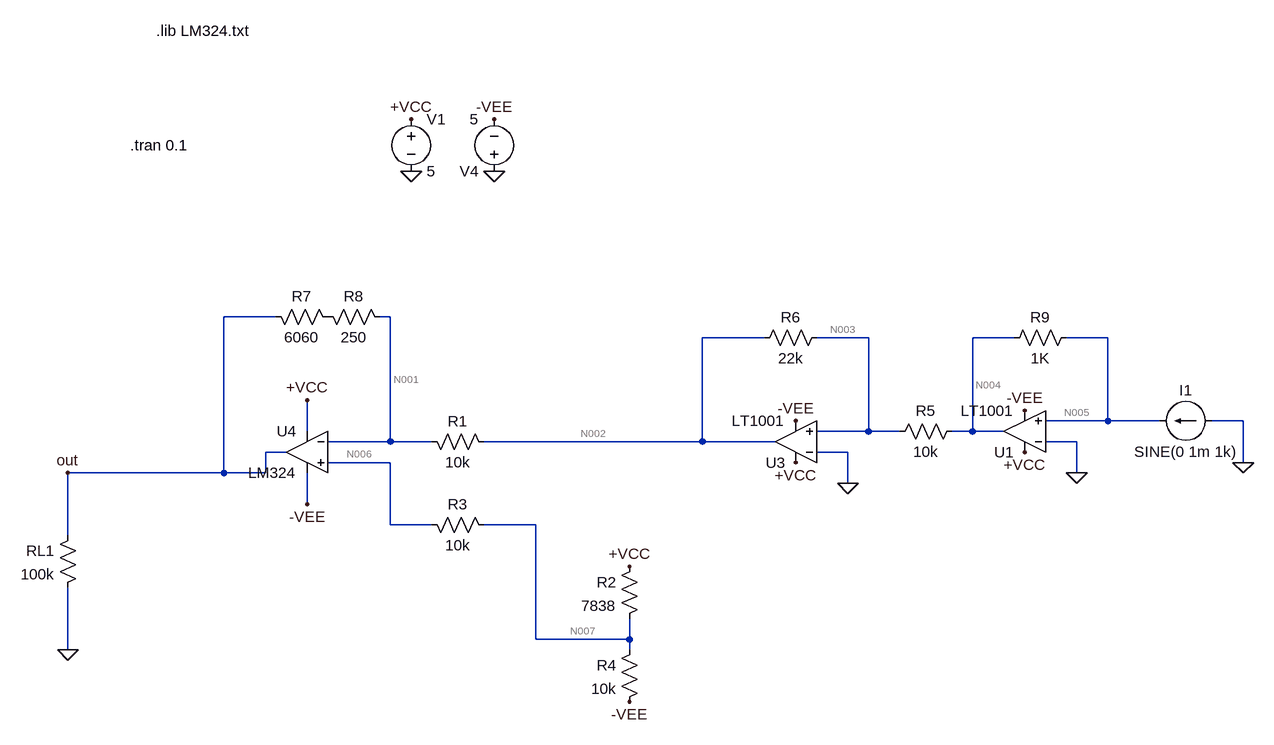
[diagram p0: schematic amplificador_i.asc]
amplificador_i.asc, the LTspice schematic file:
Version 4
SHEET 1 2848 980
WIRE -560 -32 -640 -32
WIRE -384 -32 -400 -32
WIRE 192 0 96 0
WIRE 352 0 272 0
WIRE 576 0 512 0
WIRE 720 0 656 0
WIRE 720 128 720 0
WIRE 720 128 624 128
WIRE 800 128 720 128
WIRE 928 128 880 128
WIRE -512 144 -512 96
WIRE 352 144 352 0
WIRE 352 144 272 144
WIRE 400 144 352 144
WIRE 512 144 512 0
WIRE 512 144 480 144
WIRE 560 144 512 144
WIRE -384 160 -384 -32
WIRE -384 160 -480 160
WIRE -320 160 -384 160
WIRE 96 160 96 0
WIRE 96 160 -240 160
WIRE 208 160 96 160
WIRE 672 160 624 160
WIRE -544 176 -576 176
WIRE 320 176 272 176
WIRE -384 192 -480 192
WIRE 928 192 928 128
WIRE -640 208 -640 -32
WIRE -640 208 -880 208
WIRE -576 208 -576 176
WIRE -576 208 -640 208
WIRE 672 208 672 160
WIRE 320 224 320 176
WIRE -512 256 -512 208
WIRE -384 288 -384 192
WIRE -320 288 -384 288
WIRE -160 288 -240 288
WIRE -880 304 -880 208
WIRE -160 464 -160 288
WIRE -16 464 -16 432
WIRE -16 464 -160 464
WIRE -880 480 -880 384
WIRE -16 480 -16 464
FLAG -512 96 +VCC
FLAG -352 -256 0
FLAG -352 -336 +VCC
FLAG -224 -256 0
FLAG -224 -336 -VEE
FLAG -512 256 -VEE
FLAG -880 480 0
FLAG -880 208 out
FLAG -16 352 +VCC
FLAG -16 560 -VEE
FLAG 592 112 -VEE
FLAG 592 176 +VCC
FLAG 672 208 0
FLAG 928 192 0
FLAG 240 128 -VEE
FLAG 240 192 +VCC
FLAG 320 224 0
SYMBOL voltage -352 -352 R0
WINDOW 123 0 0 Left 2
WINDOW 39 0 0 Left 2
SYMATTR InstName V1
SYMATTR Value 5
SYMBOL res -336 144 M90
WINDOW 0 0 56 VBottom 2
WINDOW 3 32 56 VTop 2
SYMATTR InstName R1
SYMATTR Value 10k
SYMBOL voltage -224 -240 R180
WINDOW 123 0 0 Left 2
WINDOW 39 0 0 Left 2
SYMATTR InstName V4
SYMATTR Value 5
SYMBOL Opamps\\opamp2 -512 112 M0
SYMATTR InstName U4
SYMATTR Value LM324
SYMBOL res -864 288 M0
SYMATTR InstName RL1
SYMATTR Value 100k
SYMBOL res -336 272 M90
WINDOW 0 0 56 VBottom 2
WINDOW 3 32 56 VTop 2
SYMATTR InstName R3
SYMATTR Value 10k
SYMBOL res -576 -48 M90
WINDOW 0 0 56 VBottom 2
WINDOW 3 32 56 VTop 2
SYMATTR InstName R7
SYMATTR Value 6060
SYMBOL res -496 -48 M90
WINDOW 0 0 56 VBottom 2
WINDOW 3 32 56 VTop 2
SYMATTR InstName R8
SYMATTR Value 250
SYMBOL res 0 336 M0
SYMATTR InstName R2
SYMATTR Value 7838
SYMBOL res 0 464 M0
SYMATTR InstName R4
SYMATTR Value 10k
SYMBOL Opamps\\LT1001 592 208 R180
SYMATTR InstName U1
SYMBOL Opamps\\LT1001 240 224 R180
SYMATTR InstName U3
SYMBOL res 496 128 R90
WINDOW 0 0 56 VBottom 2
WINDOW 3 32 56 VTop 2
SYMATTR InstName R5
SYMATTR Value 10k
SYMBOL res 288 -16 R90
WINDOW 0 0 56 VBottom 2
WINDOW 3 32 56 VTop 2
SYMATTR InstName R6
SYMATTR Value 22k
SYMBOL res 672 -16 R90
WINDOW 0 0 56 VBottom 2
WINDOW 3 32 56 VTop 2
SYMATTR InstName R9
SYMATTR Value 1K
SYMBOL current 880 128 R90
WINDOW 0 -32 40 VBottom 2
WINDOW 3 32 40 VTop 2
WINDOW 123 0 0 Left 0
WINDOW 39 0 0 Left 0
SYMATTR InstName I1
SYMATTR Value SINE(0 1m 1k)
TEXT -784 -296 Left 2 !.tran 0.1
TEXT -744 -472 Left 2 !.lib LM324.txt

The netlist it stands for:
* amplificador_i.asc
V1 +VCC 0 5
R1 N001 N002 10k
V4 0 -VEE 5
XU4 N006 N001 +VCC -VEE out LM324  ; pins In+ In- V+ V- OUT
RL1 out 0 100k
R3 N006 N007 10k
R7 out P001 6060
R8 P001 N001 250
R2 +VCC N007 7838
R4 N007 -VEE 10k
XU1 N005 0 +VCC -VEE N004 LT1001  ; pins In+ In- V+ V- OUT
XU3 N003 0 +VCC -VEE N002 LT1001  ; pins In+ In- V+ V- OUT
R5 N004 N003 10k
R6 N003 N002 22k
R9 N005 N004 1K
I1 0 N005 SINE(0 1m 1k)
.tran 0.1
.lib LM324.txt
.lib LTC.lib
.backanno
.end

* Results of the author's LTspice run, read from the files saved beside the schematic
* Operating Point, zero values left out:
*   V(+vcc) = 5 V
*   V(n001) = 606.2 mV
*   V(n002) = 4.055 V
*   V(-vee) = -5 V
*   V(out) = -1.57 V
*   V(n006) = 606.3 mV
*   V(n007) = 606.1 mV
*   V(p001) = 520 mV
*   V(n005) = 2.848 V
*   V(n004) = 4.021 V
*   V(n003) = 1.854 V
*   I(R9) = -1.173 mA
*   I(R6) = -100.1 µA
*   I(R5) = 216.7 µA
*   I(R4) = 560.6 µA
*   I(R2) = 560.6 µA
*   I(R8) = -344.9 µA
*   I(R7) = -344.9 µA
*   I(R3) = 19.86 nA
*   I(Rl1) = -15.7 µA
*   I(R1) = -344.8 µA
*   I(V4) = -4.549 mA
*   I(V1) = -6.369 mA
*   Ix(u4:1) = -19.86 nA
*   Ix(u4:2) = -19.89 nA
*   Ix(u4:3) = 340 µA
*   Ix(u4:4) = -339.9 µA
*   Ix(u4:5) = 360.6 µA
*   Ix(u1:1) = 1.173 mA
*   Ix(u1:2) = -1.173 mA
*   Ix(u1:3) = 2.994 mA
*   Ix(u1:4) = -1.612 mA
*   Ix(u1:5) = -1.389 mA
*   Ix(u3:1) = 316.8 µA
*   Ix(u3:2) = -316.8 µA
*   Ix(u3:3) = 2.474 mA
*   Ix(u3:4) = -2.036 mA
*   Ix(u3:5) = -444.9 µA
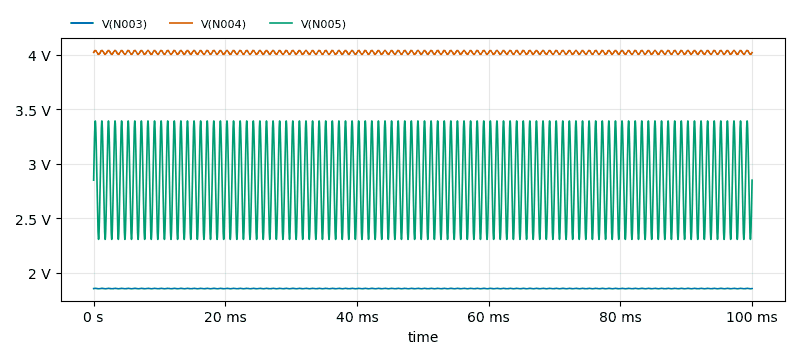
[diagram p1: Transient Analysis of amplificador_i.asc, plotted from the saved traces]
* Transient Analysis, 1 run:
*   V(N003): min 1.851 V, max 1.856 V, average 1.854 V, rms 1.854 V, last 1.854 V
*   V(N004): min 4.002 V, max 4.04 V, average 4.021 V, rms 4.021 V, last 4.021 V
*   V(N005): min 2.305 V, max 3.392 V, average 2.848 V, rms 2.874 V, last 2.848 V